# Altium schematic sheet 2-Electrovalves.SchDoc
size A4; Author: Fabian Castaño; CompanyName: UdeA; Engineer: Fabian Castaño; Organization: Universidad de Antioquia; Address1: UdeA; Address2: Medellín; Address3: Antioquia; Address4: Colombia 050010; DocumentNumber: 3; Revision: Jaime Osorio; SheetNumber: 3; SheetTotal: 12
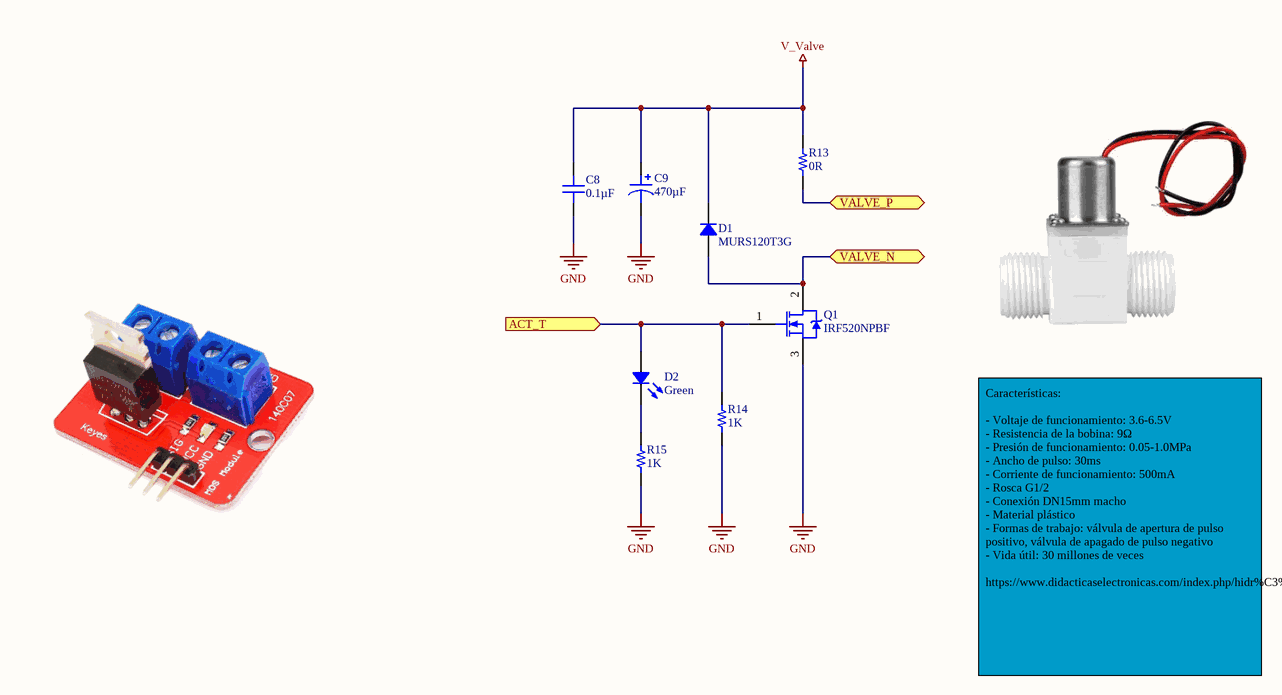
[diagram p0: 2-Electrovalves.SchDoc]

## Parts
C8  0.1µF  [CAP 0805_2012]
C9  470µF  [CAP TH ALUM ELEC D10.00mm S5.00mm H14.50mm]
D1  MURS120T3G  [DO214AA SMB]
D2  Green  [LED 0805_2012 YELLOW]
Q1  IRF520NPBF  [INTR-TO-220AB-3]
R13  0R  [RES 0805_2012]
R14  1K  [RES 0805_2012]
R15  1K  [RES 0805_2012]

## Ports
ACT_T (in), VALVE_N, VALVE_P

## Nets
GND: C8.1 C9.2 Q1.3(S) R14.1 R15.1
V_Valve: C8.2 C9.1 D1.2 R13.2
ACT_T: D2.1 Q1.1(G) R14.2 ; port ACT_T
VALVE_N: D1.1 Q1.2(D) ; port VALVE_N
VALVE_P: R13.1 ; port VALVE_P
NetD2_2: D2.2 R15.2

## Notes on the sheet
- Características:
  - Voltaje de funcionamiento: 3.6-6.5V
  - Resistencia de la bobina: 9Ω
  - Presión de funcionamiento: 0.05-1.0MPa
  - Ancho de pulso: 30ms
  - Corriente de funcionamiento: 500mA
  - Rosca G1/2
  - Conexión DN15mm macho
  - Material plástico
  - Formas de trabajo: válvula de apertura de pulso positivo, válvula de apagado de pulso negativo
  - Vida útil: 30 millones de veces
  https://www.didacticaselectronicas.com/index.php/hidr%C3%A1ulica-y-neum%C3%A1tica/v%C3%A1lvulas/electrov%C3%A1lvula-pl%C3%A1stica-211b-v%C3%A1lvulas-solenoides-electrov%C3%A1lvulas-sensores-de-flujo-electro-valvulas-v%C3%A1lvulas-electromagn%C3%A9ticas-de-pulsos-pl%C3%A1sticas-de-pulsos-detail
- Title
- Size:
- Date:
- A4
- Enginner:
- Time:
- Revision:
- Sheet
- of
- Author:
- File:

## Library data of the parts
C8 = C0805C104M5RACAUTO: CAP CER 0.1UF 50V X7R 0805; Manufacturer: KEMET; Tolerance: ±20%; Part Number: C0805C104M5RACAUTO; Value: 0.1µF; Applications: Automotive, Bypass, Decoupling; Capacitance: 0.1µF; ComponentLink1Description: Datasheet; ComponentLink1URL: https://api.kemet.com/component-edge/download/datasheet/C0805C104M5RACAUTO.pdf; ComponentLink2Description: DigiKey Link; ComponentLink2URL: http://digikey.com/product-detail/en/kemet/C0805C104M5RACAUTO/399-12977-1-ND/5762259; Device Package: 0805 (2012 Metric); LastUpdated: 2/09/2020 01:04:42; Lifecycle Status: Active; Minimum Order: 1; Mounting Type: Surface Mount, MLCC; Operating Temperature: -55°C ~ 125°C; Package / Case: 0805 (2012 Metric); Packaging: TapeAndReel; PartId: 2568; Part Status: Active; Price: 0.02; Ratings: AEC-Q200; Series: SMD Auto X7R; Size / Dimension: 0.079" L x 0.049" W (2.00mm x 1.25mm); Supplier 1: DigiKey; Supplier Part Number 1: 399-12977-1-ND; Temperature Coefficient: X7R; Thickness (Max): 0.035" (0.88mm); Voltage - Rated: 50V
C9 = UBT1J470MPD1TD: CAP ALUM 47UF 20% 63V RADIAL; manufacturer: Nichicon; Capacitance: 47µF; Impedance: 590 mOhms; Lifetime @ Temp.: 3000 Hrs @ 125°C; Polarization: Polar; Ripple Current @ High Frequency: 530mA @ 100kHz; Ripple Current @ Low Frequency: 265mA @ 120Hz; Part Number: UBT1J470MPD1TD; Applications: Automotive; componentlink1description: Datasheet; componentlink1url: http://nichicon-us.com/english/products/pdfs/e-ubt.pdf; componentlink2description: DigiKey Link; componentlink2url: http://digikey.com/product-detail/en/nichicon/UBT1J470MPD1TD/493-4512-1-ND/2650352; Device Package: Radial, Can; Height - Seated (Max): 0.571" (14.50mm); lastupdated: 2/09/2020 1:31:15 a. m.; Lead Spacing: 0.197" (5.00mm); Lifecycle Status: Active; Minimum Order: 1; Mounting Type: Through Hole; Operating Temperature: -40°C ~ 125°C; Package / Case: Radial, Can; packaging: TapeAndBox; partid: 11460; Part Status: Active; price: 0.29; series: UBT; Size / Dimension: 0.394" Dia (10.00mm); Supplier 1: DigiKey; Supplier Part Number 1: 493-4512-1-ND; Tolerance: ±20%; value: 470µF; Voltage - Rated: 63V
D1 = MURS120T3G: DIODE GEN PURP 200V 2A SMB; Manufacturer: ON Semiconductor; Current - Reverse Leakage @ Vr: 2µA @ 200V; Diode Type: Standard; Reverse Recovery Time (trr): 35ns; Speed: Fast Recovery =< 500ns, > 200mA (Io); Voltage - Forward (Vf) (Max) @ If: 875mV @ 1A; Part Number: MURS120T3G; ComponentLink1Description: Datasheet; ComponentLink1URL: https://www.onsemi.com/pub/Collateral/MURS120T3-D.PDF; ComponentLink2Description: DigiKey Link; ComponentLink2URL: http://digikey.com/product-detail/en/on-semiconductor/MURS120T3G/MURS120T3GOSCT-ND/964577; Current - Average Rectified (Io): 2A; LastUpdated: 12/04/2022 10:48:18 p. m.; Lifecycle Status: Active; Minimum Order: 1; Mounting Type: Surface Mount; Operating Temperature - Junction: -65°C ~ 175°C; Package / Case: DO-214AA, SMB; Packaging: TapeAndReel; PartId: 35; Part Status: Active; Price: 0.09; Series: -; Supplier 1: DigiKey; Supplier Part Number 1: MURS120T3GOSCT-ND; Supplier Device Package: SMB; Voltage - DC Reverse (Vr) (Max): 200V
D2 = APT2012SYCK: LED YELLOW CLEAR CHIP SMD; Manufacturer: Kingbright; Configuration: Standard; Current - Test: 20mA; Lens Color: Colorless; Lens Size: 1.30mm x 1.25mm; Lens Style: Rectangle with Flat Top; Millicandela Rating: 150mcd; Viewing Angle: 120°; Voltage - Forward (Vf) (Typ): 2V; Wavelength - Dominant: 590nm; Part Number: APT2012SYCK; Color: Yellow; ComponentLink1Description: Datasheet; ComponentLink1URL: http://www.kingbrightusa.com/images/catalog/SPEC/APT2012SYCK.pdf; ComponentLink2Description: DigiKey Link; ComponentLink2URL: https://www.digikey.com/en/products/detail/kingbright/APT2012SYCK/1747533; Device Package: 0805 (2012 Metric); Height (Max): 0.75mm; LastUpdated: 12/04/2022 10:52:50 p. m.; Lens Transparency: Clear; Lifecycle Status: Active; Minimum Order: 1; Mounting Type: Surface Mount; Package / Case: 0805 (2012 Metric); Packaging: TapeAndReel; PartId: 47; Part Status: Active; Price: 0.05; Series: -; Size / Dimension: 2.00mm L x 1.25mm W; Supplier 1: DigiKey; Supplier Part Number 1: 754-1134-1-ND; Supplier Device Package: Chip LED; Value: Green; Wavelength - Peak: 590nm
Q1 = CMP-2100-03647-1: HEXFET(R) Power MOSFET, 100 V, 9.7 A, 0.2 Ohm, -55 to 175 degC, 3-Pin FM (TO-220AB), RoHS, Tube; Manufacturer: International Rectifier; Element Configuration: Single; Rds On Max: 200mOhm; Drain to Source Voltage (Vdss): 100V; Number of Elements: 1; Continuous Drain Current (ID): 9.7A; Input Capacitance: 330pF; Gate to Source Voltage (Vgs): 20V; Power Dissipation: 48W; Rise Time: 23ns; Turn-Off Delay Time: 32ns; Turn-On Delay Time: 4.5ns; Datasheet URL: http://www.infineon.com/dgdl/irf520npbf.pdf?fileId=5546d462533600a4015355e340711985; Max Operating Temperature: 175degC; Height: 15.24mm; RoHSCompliant: true; Package Description: 3-Pin Flange Mount, Body 4.445 x 10.415 mm, Pitch 2.54 mm; Manufacturer URL: http://internationalrectifier.com/; Length: 10.54mm; Mount: ThroughHole; Lead Free: LeadFree; Drain to Source Resistance: 200mOhm; Drain to Source Breakdown Voltage: 100V; Number of Pins: 3; Case/Package: TO-220AB; Package Quantity: 50; Lead Pitch: 2.54mm; REACH SVHC: NoSVHC; Package Reference: TO-220AB; Radiation Hardening: No; Packaging: Rail/Tube; Min Operating Temperature: -55degC; Width: 4.69mm; Fall Time: 23ns; Max Power Dissipation: 48W; Datasheet Version: 37926.0; Voltage Rating (DC): 100V; Current Rating: 9.7A
R13-R15 = RC0805FR-071K47L: RES SMD 1.47K OHM 1% 1/8W 0805; Manufacturer: Yageo; Power (Watts): 0.125W, 1/8W; Resistance: 1.47 kOhms; Temperature Coefficient: ±100ppm/°C; Part Number: RC0805FR-071K47L; ComponentLink1Description: Datasheet; ComponentLink1URL: https://www.yageo.com/upload/media/product/productsearch/datasheet/rchip/PYu-RC_Group_51_RoHS_L_10.pdf; ComponentLink2Description: DigiKey Link; ComponentLink2URL: http://digikey.com/product-detail/en/yageo/RC0805FR-071K47L/311-1.47KCRCT-ND/730440; Composition: Thick Film; Device Package: 0805 (2012 Metric); Features: Moisture Resistant; Height - Seated (Max): 0.024" (0.60mm); LastUpdated: 2/09/2020 01:14:46; Lifecycle Status: Active; Minimum Order: 1; Number of Terminations: 2; Operating Temperature: -55°C ~ 155°C; Package / Case: 0805 (2012 Metric); Packaging: CutTape; PartId: 44768; Part Status: Active; Price: 0.10; Series: RC; Size / Dimension: 0.079" L x 0.049" W (2.00mm x 1.25mm); Supplier 1: DigiKey; Supplier Part Number 1: 311-1.47KCRCT-ND; Supplier Device Package: 0805; Tolerance: ±1%
  R13: Value: 0R
  R14 R15: Value: 1K